# EasyEDA Pro project 步进电机天空星转接板.eprj, board PCB2
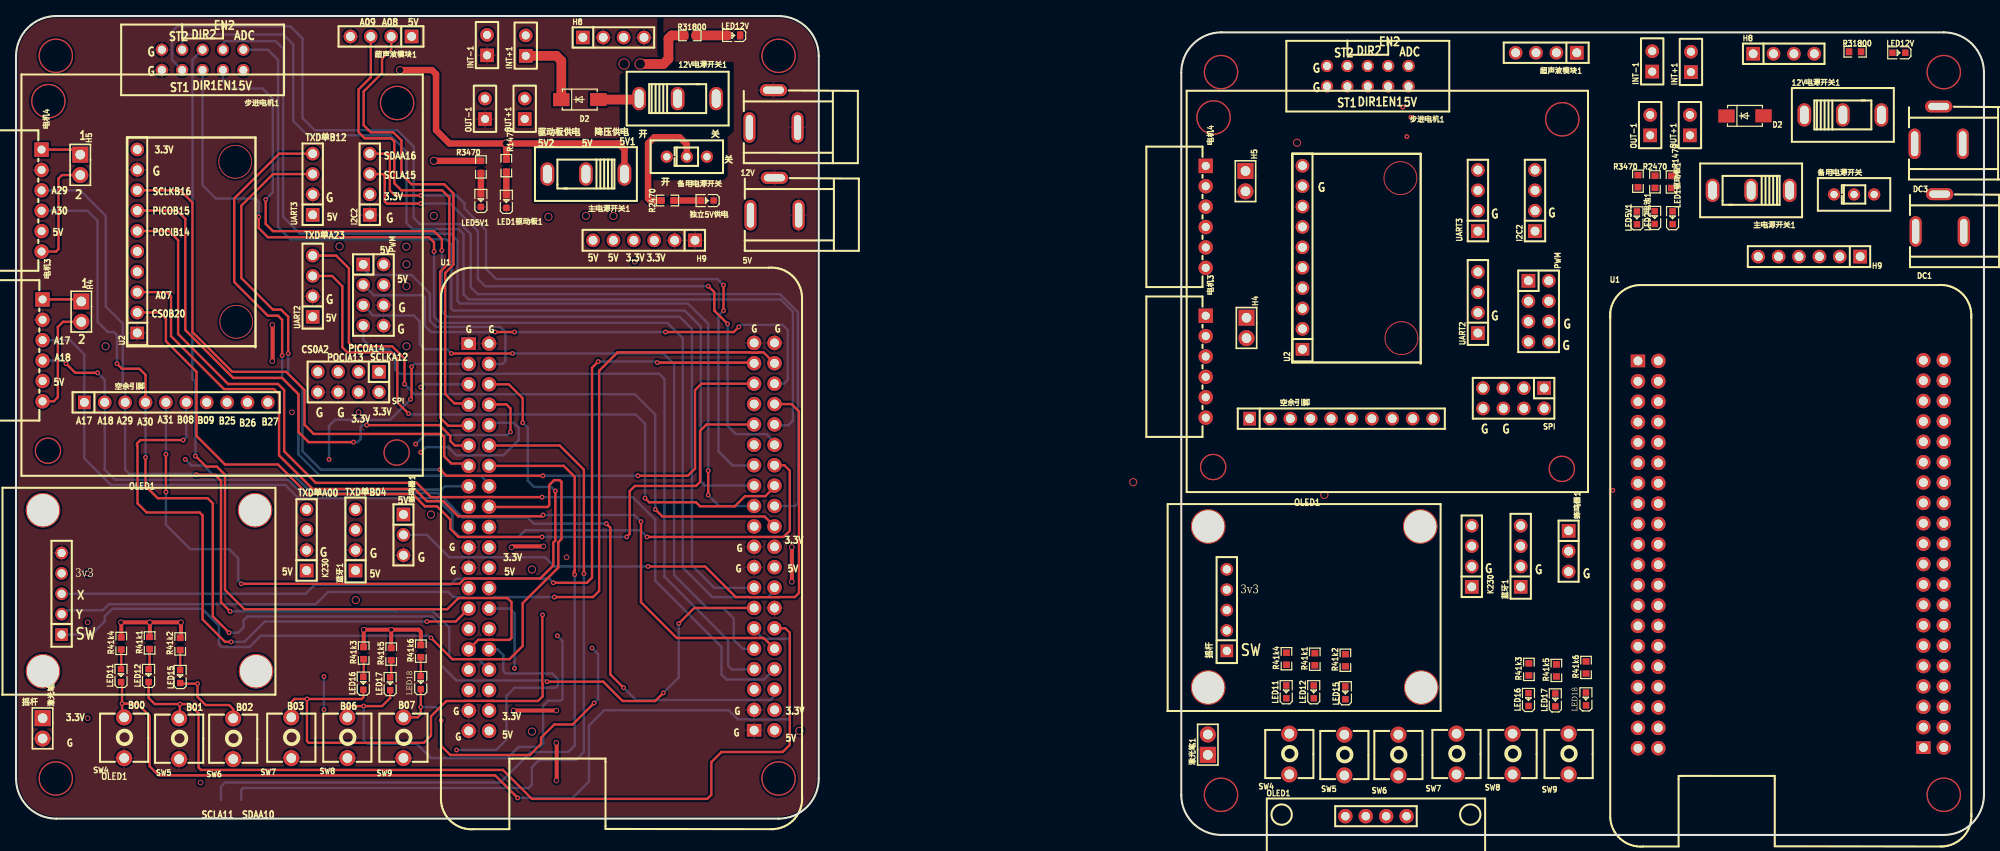
[diagram p4: board, top side]
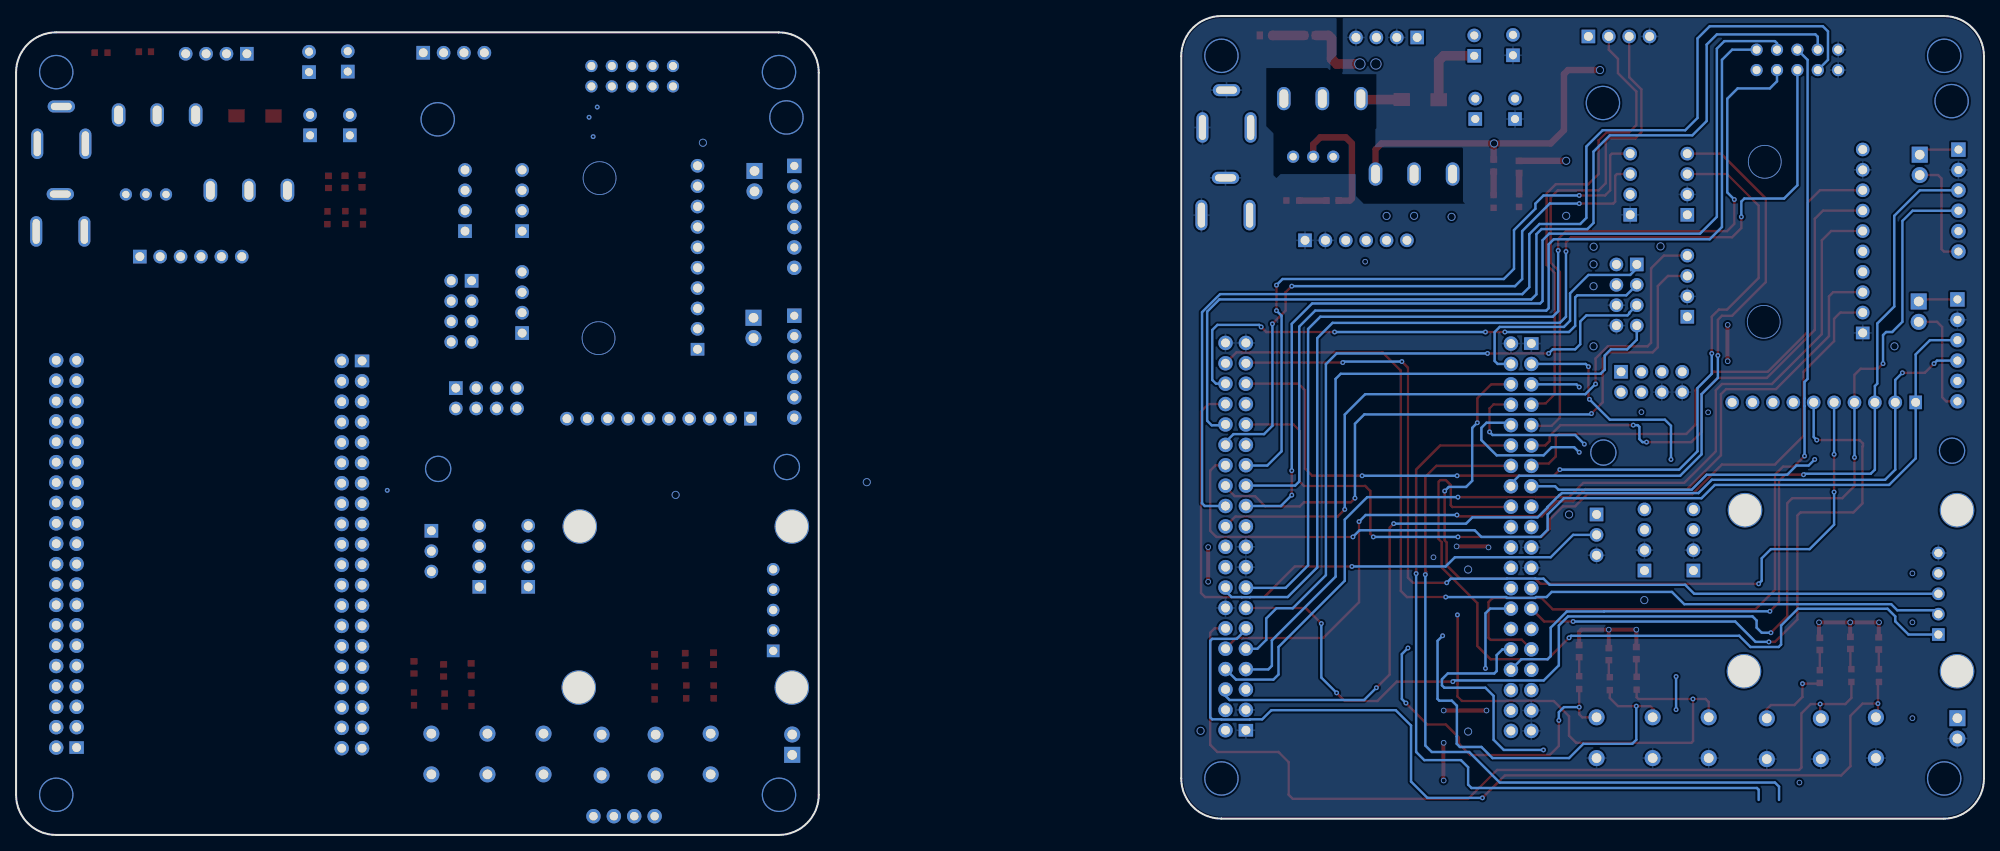
[diagram p5: board, bottom side, seen from below]

Outline 245.16 x 102.03 mm; copper layers: Top Layer, Inner1, Inner2, Bottom Layer. Coordinates in mm from the lower left corner of the outline.
Outline path: 0,97.03 0,7.03 arc(1.46,3.5) 5,2.03 95,2.03 arc(98.54,3.5) 100,7.03 100,97.03 arc(98.54,100.57) 95,102.03 5,102.03 arc(1.46,100.57) 0,97.03 ; 145.16,95 145.16,5 arc(146.63,1.46) 150.16,0 240.16,0 arc(243.7,1.46) 245.16,5 245.16,95 arc(243.7,98.54) 240.16,100 150.16,100 arc(146.63,98.54) 145.16,95
Stack: Top Layer 0.035mm / Dielectric1 1.51mm FR4 er 4.5 / Inner1 0.035mm / Dielectric2 0.48mm PP er 4.5 / Inner2 0.035mm / Dielectric3 0.48mm PP er 4.5 / Bottom Layer 0.035mm

## Design rules (mm)
template: JLCPCB Capability(Two Layers Board)
spacing copperThickness1oz (default): track to track 0.102, other pairs 0.152 to 0.3
spacing copperThickness2oz: track to track 0.203, other pairs 0.152 to 0.3
track width copperThickness1oz (default): min 0.127, default 0.254, max 2.54
track width copperThickness2oz: min 0.203, default 0.254, max 2.54
differential pair differentialPair (default): width min 0.127, default 0.254, max 2.54; gap min 0.152, default 0.152
via viaSize (default): diameter min 0.5, default 0.61, max 10; hole min 0.3, default 0.305, max 6.3

## Placement (name value [footprint] x y rotation side)
5V  DC005-T25  [DC-IN-TH_DC-005-20A-1]  94.49 79.55 180 top
12V  DC005-T25  [DC-IN-TH_DC-005-20A-1]  94.36 90.48 180 top
12V电源开关1  -  [SW-TH_SHOU-HAN_SS12D10G4]  227.58 89.71 0 top
12V电源开关1#2  -  [SW-TH_SHOU-HAN_SS12D10G4]  82.42 91.75 0 top
D2  -  [SMA_L4.3-W2.6-LS5.0-FD]  215.39 89.59 180 top
D2#2  -  [SMA_L4.3-W2.6-LS5.0-FD]  70.23 91.62 180 top
DC1  DC005-T25  [DC-IN-TH_DC-005-20A-1]  239.65 77.52 180 top
DC3  DC005-T25  [DC-IN-TH_DC-005-20A-1]  239.52 88.44 180 top
H4  -  [HDR-TH_2P-P2.54-V-M]  153.29 63.17 270 top
H4#2  -  [HDR-TH_2P-P2.54-V-M]  8.13 65.2 270 top
H5  -  [HDR-TH_2P-P2.54-V-M]  153.16 81.46 270 top
H5#2  -  [HDR-TH_2P-P2.54-V-M]  8 83.49 270 top
H8  -  [HDR-TH_4P-P2.54-V-M]  220.22 97.33 0 top
H8#2  -  [HDR-TH_4P-P2.54-V-M]  74.42 99.37 0 top
H9  -  [HDR-TH_6P-P2.54-V-M]  223.39 72.06 180 top
H9#2  -  [HDR-TH_6P-P2.54-V-M]  78.23 74.09 180 top
I2C2  -  [HDR-TH_4P-P2.54-V-M]  189.23 79.05 90 top
I2C2#2  -  [HDR-TH_4P-P2.54-V-M]  44.07 81.08 90 top
INT+1  -  [HDR-TH_2P-P2.54-V-F]  208.66 96.32 90 top
INT+1#2  -  [HDR-TH_2P-P2.54-V-F]  63.5 98.35 90 top
INT-1  -  [HDR-TH_2P-P2.54-V-F]  203.84 96.38 90 top
INT-1#2  -  [HDR-TH_2P-P2.54-V-F]  58.68 98.41 90 top
K230  -  [HDR-TH_4P-P2.54-V-M]  181.36 34.72 90 top
K230#2  -  [HDR-TH_4P-P2.54-V-M]  36.2 36.75 90 top
LED1驱动板1  LTST-C191KSKT  [LED0603-RD-YELLOW]  206.37 76.9 90 top
LED1驱动板1#2  -  [LED0603-RD-YELLOW]  61.09 78.93 90 top
LED2电池1  LTST-C191KSKT  [LED0603-RD-YELLOW]  204.14 76.92 90 top
LED5V1  LTST-C191KSKT  [LED0603-RD-YELLOW]  201.93 76.89 90 top
LED5V1#2  -  [LED0603-RD-YELLOW]  57.91 79.05 90 top
LED11  LTST-C191KSKT  [LED0603-RD-YELLOW]  158.24 17.83 90 top
LED11#2  -  [LED0603-RD-YELLOW]  13.08 19.86 90 top
LED12  LTST-C191KSKT  [LED0603-RD-YELLOW]  161.67 17.83 90 top
LED12#2  -  [LED0603-RD-YELLOW]  16.51 19.86 90 top
LED12V  -  [LED0603-RD-YELLOW]  234.57 97.46 180 top
LED12V#2  -  [LED0603-RD-YELLOW#2]  89.41 99.62 180 top
LED15  LTST-C191KSKT  [LED0603-RD-YELLOW]  165.61 17.7 90 top
LED15#2  -  [LED0603-RD-YELLOW]  20.45 19.74 90 top
LED16  LTST-C191KSKT  [LED0603-RD-YELLOW]  188.42 16.87 90 top
LED16#2  -  [LED0603-RD-YELLOW]  43.26 18.9 90 top
LED17  LTST-C191KSKT  [LED0603-RD-YELLOW]  191.77 16.81 90 top
LED17#2  -  [LED0603-RD-YELLOW]  46.61 18.85 90 top
LED18  -  [LED0603-RD-YELLOW]  195.58 16.94 90 top
LED18#2  -  [LED0603-RD-YELLOW]  50.42 18.97 90 top
NOREF  -  [Pad_e420]  3.35 20.4 180 top
NOREF#2  -  [Pad_e189]  148.51 18.37 180 top
NOREF#3  -  [Pad_e423]  29.9 20.4 180 top
NOREF#4  -  [Pad_e192]  175.06 18.37 180 top
NOREF#5  -  [Pad_e191]  174.93 38.43 180 top
NOREF#6  -  [Pad_e422]  29.77 40.46 180 top
NOREF#7  -  [Pad_e190]  148.51 38.43 180 top
NOREF#8  -  [Pad_e421]  3.35 40.46 180 top
OLED1  HS96L03W2C03  [OLED-TH_L27.8-W27.2-P2.54_C9900033791]  169.42 2.34 0 top
OUT+1  -  [HDR-TH_2P-P2.54-V-F]  208.53 88.44 90 top
OUT+1#2  -  [HDR-TH_2P-P2.54-V-F]  63.37 90.48 90 top
OUT-1  -  [HDR-TH_2P-P2.54-V-F]  203.58 88.44 90 top
OUT-1#2  -  [HDR-TH_2P-P2.54-V-F]  58.42 90.48 90 top
PWM  -  [HDR-TH_8P-P2.54-V-M-R2-C4-S2.54]  189.68 65.24 270 top
PWM#2  -  [HDR-TH_8P-P2.54-V-M-R2-C4-S2.54]  44.52 67.27 270 top
R41k1  -  [R0603#2]  161.8 21.9 90 top
R41k1#2  -  [R0603#2]  16.64 23.93 90 top
R41k2  -  [R0603#2]  165.61 21.77 90 top
R41k2#2  -  [R0603#2]  20.45 23.8 90 top
R41k3  -  [R0603#2]  188.47 20.62 90 top
R41k3#2  -  [R0603#2]  43.31 22.66 90 top
R41k4  -  [R0603#2]  158.27 21.96 90 top
R41k4#2  -  [R0603#2]  13.11 23.86 90 top
R41k5  1kΩ  [R0603#2]  191.9 20.5 90 top
R41k5#2  -  [R0603#2]  46.74 22.53 90 top
R41k6  -  [R0603#2]  195.59 20.87 90 top
R41k6#2  -  [R0603#2]  50.43 22.9 90 top
R1470  470Ω  [R0603#2]  206.24 81.36 270 top
R1470#2  -  [R0603#2]  61.08 83.39 270 top
R2470  470Ω  [R0603#2]  204.18 81.38 270 top
R2470#2  -  [R0603#2]  81.15 79.05 0 top
R3470  470Ω  [R0603#2]  202.06 81.46 270 top
R3470#2  -  [R0603#2]  57.91 83.24 270 top
R31800  -  [R0603]  83.95 99.62 0 top
R31800#2  -  [R0603#2]  229.11 97.59 0 top
SPI  -  [HDR-TH_8P-P2.54-V-M-R2-C4-S2.54]  186.56 54.41 180 top
SPI#2  -  [HDR-TH_8P-P2.54-V-M-R2-C4-S2.54]  41.4 56.44 180 top
SW4  K2-1104DZ-G4SW-04  [KEY-TH_2P-L6.0-W6.0-P5.00]  158.62 10.08 90 top
SW4#2  -  [KEY-TH_2P-L6.0-W6.0-P5.00]  13.46 12.12 90 top
SW5  -  [KEY-TH_2P-L6.0-W6.0-P5.00]  165.48 9.96 90 top
SW5#2  -  [KEY-TH_2P-L6.0-W6.0-P5.00]  20.32 11.99 90 top
SW6  -  [KEY-TH_2P-L6.0-W6.0-P5.00]  172.21 9.96 90 top
SW6#2  -  [KEY-TH_2P-L6.0-W6.0-P5.00]  27.05 11.99 90 top
SW7  -  [KEY-TH_2P-L6.0-W6.0-P5.00]  179.45 10.08 90 top
SW7#2  -  [KEY-TH_2P-L6.0-W6.0-P5.00]  34.29 12.12 90 top
SW8  -  [KEY-TH_2P-L6.0-W6.0-P5.00]  186.44 10.08 90 top
SW8#2  -  [KEY-TH_2P-L6.0-W6.0-P5.00]  41.27 12.12 90 top
SW9  -  [KEY-TH_2P-L6.0-W6.0-P5.00]  193.42 10.08 90 top
SW9#2  -  [KEY-TH_2P-L6.0-W6.0-P5.00]  48.26 12.12 90 top
U1  -  [COMM-TH_LCKFB-TMX-MSPM0G3507]  221.11 34.98 0 top
U1#2  -  [COMM-TH_LCKFB-TMX-MSPM0G3507]  75.44 37.14 0 top
U2  KH-2FH-1X20P-H4.3  [HDR-TH_10P-P2.54-V-F]  160.26 71.95 90 top
U2#2  -  [HDR-TH_10P-P2.54-V-F]  15.1 73.98 90 top
UART2  -  [HDR-TH_4P-P2.54-V-F]  182.12 66.35 90 top
UART2#2  -  [HDR-TH_4P-P2.54-V-F]  36.96 68.38 90 top
UART3  -  [HDR-TH_4P-P2.54-V-M]  182.12 79.05 90 top
UART3#2  -  [HDR-TH_4P-P2.54-V-M]  36.96 81.08 90 top
主电源开关1  SS12D10G5  [SW-TH_SHOU-HAN_SS12D10G4]  216.15 80.32 180 top
主电源开关1#2  -  [SW-TH_SHOU-HAN_SS12D10G4]  70.99 82.35 180 top
备用电源开关  -  [SW-TH_3P-L8.8-W3.9-P2.50_SS12D00G3]  228.98 79.81 0 top
备用电源开关#2  -  [SW-TH_3P-L8.8-W3.9-P2.50_SS12D00G3]  83.57 84.51 0 top
摇杆1  2.54-1*5P母  [HDR-TH_5P-P2.54-V-F]  150.84 28.02 90 top
摇杆1#2  -  [HDR-TH_5P-P2.54-V-F]  5.67 30.05 90 top
步进电机1  2.54-2*5P简牛  [IDC-TH_10P-P2.54_C5665]  168.4 94.54 180 top
步进电机1#2  -  [IDC-TH_10P-P2.54_C5665]  23.24 96.57 180 top
激光笔1  PZ254V-11-02P  [HDR-TH_2P-P2.54-V-M]  148.47 11.25 90 top
激光笔1#2  -  [HDR-TH_2P-P2.54-V-M]  3.31 13.28 270 top
独立5V供电  LTST-C191KSKT  [LED0603-RD-YELLOW]  86.11 79.05 180 top
电机3  -  [CONN-TH_6P-P2.54_HCTL_XH-6AW_C2908615]  148.21 58.34 270 top
电机3#2  -  [CONN-TH_6P-P2.54_HCTL_XH-6AW_C2908615]  3.3 60.38 270 top
电机4  -  [CONN-TH_6P-P2.54_HCTL_XH-6AW_C2908615]  148.21 77.01 270 top
电机4#2  -  [CONN-TH_6P-P2.54_HCTL_XH-6AW_C2908615]  3.17 79.05 270 top
空余引脚  -  [HDR-TH_10P-P2.54-V-M]  165.1 51.87 0 top
空余引脚#2  -  [HDR-TH_10P-P2.54-V-M]  19.94 53.9 0 top
蓝牙1  2.54-1*4P母  [HDR-TH_4P-P2.54-V-F]  187.45 34.72 90 top
蓝牙1#2  -  [HDR-TH_4P-P2.54-V-F]  42.29 36.75 90 top
蜂鸣器1  PZ254V-11-03P  [HDR-TH_3P-P2.54-V-M]  193.42 35.36 270 top
蜂鸣器1#2  -  [HDR-TH_3P-P2.54-V-M]  48.26 37.39 270 top
超声波模块1  KH-2.54FH-1X4P-H8.5  [HDR-TH_4P-P2.54-V-F]  190.63 97.46 180 top
超声波模块1#2  -  [HDR-TH_4P-P2.54-V-F]  45.47 99.49 180 top

## Footprints (pads in the part's own frame, mm; a bottom-side part is the same pattern mirrored in y, then rotated)
COMM-TH_LCKFB-TMX-MSPM0G3507
  rect 1.8x1.575 hole 1.1: 1(-19.05,24.09) 41(16.51,-24.09)
  round 1.8 hole 1.1: 2(-16.51,24.09) 3(-19.05,21.549) 4(-16.51,21.549) 5(-19.05,19.009) 6(-16.51,19.009) 7(-19.05,16.47) 8(-16.51,16.47) 9(-19.05,13.93) 10(-16.51,13.93) 11(-19.05,11.389) 12(-16.51,11.389) 13(-19.05,8.85) 14(-16.51,8.85) 15(-19.05,6.309) 16(-16.51,6.309) 17(-19.05,3.769) 18(-16.51,3.769) 19(-19.05,1.23) 20(-16.51,1.23) 21(-19.05,-1.31) 22(-16.51,-1.31) 23(-19.05,-3.85) 24(-16.51,-3.85) 25(-19.05,-6.391) 26(-16.51,-6.391) 27(-19.05,-8.931) 28(-16.51,-8.931) 29(-19.05,-11.47) 30(-16.51,-11.47) 31(-19.05,-14.011) 32(-16.51,-14.011) 33(-19.05,-16.55) 34(-16.51,-16.55) 35(-19.05,-19.09) 36(-16.51,-19.09) 37(-19.05,-21.631) 38(-16.51,-21.631) 39(-19.05,-24.171) 40(-16.51,-24.171) 42(19.05,-24.09) 43(16.51,-21.549) 44(19.05,-21.549) 45(16.51,-19.009) 46(19.05,-19.009) 47(16.51,-16.47) 48(19.05,-16.47) 49(16.51,-13.93) 50(19.05,-13.93) 51(16.51,-11.389) 52(19.05,-11.389) 53(16.51,-8.85) 54(19.05,-8.85) 55(16.51,-6.309) 56(19.05,-6.309) 57(16.51,-3.769) 58(19.05,-3.769) 59(16.51,-1.23) 60(19.05,-1.23) 61(16.51,1.31) 62(19.05,1.31) 63(16.51,3.85) 64(19.05,3.85) 65(16.51,6.391) 66(19.05,6.391) 67(16.51,8.931) 68(19.05,8.931) 69(16.51,11.47) 70(19.05,11.47) 71(16.51,14.011) 72(19.05,14.011) 73(16.51,16.55) 74(19.05,16.55) 75(16.51,19.09) 76(19.05,19.09) 77(16.51,21.631) 78(19.05,21.631) 79(16.51,24.171) 80(19.05,24.171)
CONN-TH_6P-P2.54_HCTL_XH-6AW_C2908615
  rect 1.8x1.8 hole 1: 1(-6.35,0)
  round 1.8 hole 1: 2(-3.81,0) 3(-1.27,0) 4(1.27,0) 5(3.81,0) 6(6.35,0)
DC-IN-TH_DC-005-20A-1
  oval 1.5x3.8 hole 0.9x3.1: 1(3,2.325) 2(-3,2.325)
  oval 3.4x1.5 hole 2.6x0.9: 3(0,-2.325)
HDR-TH_2P-P2.54-V-F
  rect 1.7x1.7 hole 1: 1(-1.27,0)
  round 1.7 hole 1: 2(1.27,0)
HDR-TH_2P-P2.54-V-M
  rect 2x2 hole 1.2: 1(-1.27,0)
  round 2 hole 1.2: 2(1.27,0)
HDR-TH_3P-P2.54-V-M
  rect 1.7x1.7 hole 1.1: 1(-2.54,0)
  round 1.7 hole 1.1: 2(0,0) 3(2.54,0)
HDR-TH_4P-P2.54-V-F
  rect 1.7x1.7 hole 1.1: 1(-3.81,0)
  round 1.7 hole 1.1: 2(-1.27,0) 3(1.27,0) 4(3.81,0)
HDR-TH_4P-P2.54-V-M
  rect 1.7x1.7 hole 1.1: 1(-3.81,0)
  round 1.7 hole 1.1: 2(-1.27,0) 3(1.27,0) 4(3.81,0)
HDR-TH_5P-P2.54-V-F
  rect 1.575x1.575 hole 1.02: 1(-5.08,0)
  round 1.575 hole 1.02: 2(-2.54,0) 3(0,0) 4(2.54,0) 5(5.08,0)
HDR-TH_6P-P2.54-V-M
  rect 1.7x1.7 hole 1.1: 1(-6.35,0)
  round 1.7 hole 1.1: 2(-3.81,0) 3(-1.27,0) 4(1.27,0) 5(3.81,0) 6(6.35,0)
HDR-TH_8P-P2.54-V-M-R2-C4-S2.54
  rect 1.7x1.7 hole 1.1: 1(-3.81,-1.27)
  round 1.7 hole 1.1: 2(-3.81,1.27) 3(-1.27,-1.27) 4(-1.27,1.27) 5(1.27,-1.27) 6(1.27,1.27) 7(3.81,-1.27) 8(3.81,1.27)
HDR-TH_10P-P2.54-V-F
  rect 1.575x1.7 hole 1.1: 1(-11.43,0)
  round 1.7 hole 1.1: 2(-8.89,0) 3(-6.35,0) 4(-3.81,0) 5(-1.27,0) 6(1.27,0) 7(3.81,0) 8(6.35,0) 9(8.89,0) 10(11.43,0)
HDR-TH_10P-P2.54-V-M
  rect 1.575x1.7 hole 1.1: 1(-11.43,0)
  round 1.7 hole 1.1: 2(-8.89,0) 3(-6.35,0) 4(-3.81,0) 5(-1.27,0) 6(1.27,0) 7(3.81,0) 8(6.35,0) 9(8.89,0) 10(11.43,0)
IDC-TH_10P-P2.54_C5665
  round 1.524 hole 1: 1(-5.08,-1.27) 2(-5.08,1.27) 3(-2.54,-1.27) 4(-2.54,1.27) 5(0,-1.27) 6(0,1.27) 7(2.54,-1.27) 8(2.54,1.27) 9(5.08,-1.27) 10(5.08,1.27)
KEY-TH_2P-L6.0-W6.0-P5.00
  round 2 hole 1.2: 1(-2.54,0) 2(2.54,0)
LED0603-RD-YELLOW
  rect 0.8x0.8 smd: 1(-0.799,-0.004) 2(0.799,0.004)
LED0603-RD-YELLOW#2
  rect 0.8x1 smd: 1(-0.799,-0.004) 2(0.799,0.004)
OLED-TH_L27.8-W27.2-P2.54_C9900033791
  round 1.8 hole 1.05: 1(-3.81,0) 2(-1.27,0) 3(1.27,0) 4(3.81,0)
Pad_e189
  round 4.3 hole 4: 1(0,0)
Pad_e190
  round 4.3 hole 4: 1(0,0)
Pad_e191
  round 4.3 hole 4: 1(0,0)
Pad_e192
  round 4.3 hole 4: 1(0,0)
Pad_e420
  round 4.3 hole 4: 1(0,0)
Pad_e421
  round 4.3 hole 4: 1(0,0)
Pad_e422
  round 4.3 hole 4: 1(0,0)
Pad_e423
  round 4.3 hole 4: 1(0,0)
R0603
  rect 1.1x1 smd: 1(-0.753,0)
  rect 1x1 smd: 2(0.753,0)
R0603#2
  rect 0.806x0.864 smd: 1(-0.753,0) 2(0.753,0)
SMA_L4.3-W2.6-LS5.0-FD
  rect 2.046x1.62 smd: 1(-2.304,-0.009) 2(2.304,0.009)
SW-TH_3P-L8.8-W3.9-P2.50_SS12D00G3
  round 1.524 hole 0.914: 1(-2.5,0) 2(0,0) 3(2.5,0)
SW-TH_SHOU-HAN_SS12D10G4
  oval 1.7x2.9 hole 1.1x2.3: 1(-4.8,0) 2(0,0) 3(4.8,0)

## Nets
3V3: H9.3 H9.4 H9#2.3 H9#2.4 I2C2.2 I2C2#2.2 OLED1.2 R41k1.2 R41k1#2.2 R41k2.2 R41k2#2.2 R41k3.2 R41k3#2.2 R41k4.2 R41k4#2.2 R41k5.2 R41k5#2.2 R41k6.2 R41k6#2.2 SPI.2 SPI.4 SPI#2.2 SPI#2.4 U1.22 U1.38 U1.44 U1.60 U1#2.22 U1#2.38 U1#2.44 U1#2.60 U2.10 U2#2.10 摇杆1.4 摇杆1#2.4 激光笔1.1 激光笔1#2.1
5V: H9.5 H9.6 H9#2.5 H9#2.6 K230.1 K230#2.1 PWM.2 PWM.4 PWM#2.2 PWM#2.4 R3470.1 R3470#2.1 U1.24 U1.40 U1.42 U1.58 U1#2.24 U1#2.40 U1#2.42 U1#2.58 UART2.1 UART2#2.1 UART3.1 UART3#2.1 主电源开关1.1 主电源开关1#2.2 备用电源开关.1 备用电源开关#2.1 电机3.5 电机3#2.5 电机4.5 电机4#2.5 蓝牙1.1 蓝牙1#2.1 蜂鸣器1.1 蜂鸣器1#2.1 超声波模块1.1 超声波模块1#2.1
5V1: R1470.1 R1470#2.1 主电源开关1.2 主电源开关1#2.1 步进电机1.2 步进电机1#2.2
5V2: OUT+1.1 OUT+1#2.1 主电源开关1.3 主电源开关1#2.3
12V: 12V电源开关1.1 12V电源开关1#2.1 D2.1 D2#2.1 H8.1 H8.3 H8#2.1 H8#2.3 R31800.1 R31800#2.1
AGND: U1.35 U1#2.35
GND: 5V.2 5V.3 12V.2 12V.3 DC1.2 DC1.3 DC3.2 DC3.3 H8.2 H8.4 H8#2.2 H8#2.4 H9.1 H9.2 H9#2.1 H9#2.2 I2C2.1 I2C2#2.1 INT-1.1 INT-1#2.1 K230.2 K230#2.2 LED1驱动板1.1 LED1驱动板1#2.1 LED2电池1.1 LED5V1.1 LED5V1#2.1 LED12V.1 LED12V#2.1 OLED1.1 OUT-1.1 OUT-1#2.1 PWM.6 PWM.8 PWM#2.6 PWM#2.8 SPI.6 SPI.8 SPI#2.6 SPI#2.8 SW4.1 SW4#2.1 SW5.1 SW5#2.1 SW6.1 SW6#2.1 SW7.1 SW7#2.1 SW8.1 SW8#2.1 SW9.1 SW9#2.1 U1.1 U1.2 U1.21 U1.23 U1.37 U1.39 U1.41 U1.43 U1.54 U1.57 U1.59 U1.79 U1.80 U1#2.1 U1#2.2 U1#2.21 U1#2.23 U1#2.37 U1#2.39 U1#2.41 U1#2.43 U1#2.54 U1#2.57 U1#2.59 U1#2.79 U1#2.80 U2.1 U2.9 U2#2.1 U2#2.9 UART2.2 UART2#2.2 UART3.2 UART3#2.2 摇杆1.5 摇杆1#2.5 步进电机1.9 步进电机1.10 步进电机1#2.9 步进电机1#2.10 激光笔1.2 激光笔1#2.2 独立5V供电.1 电机3.2 电机3#2.2 电机4.2 电机4#2.2 蓝牙1.2 蓝牙1#2.2 蜂鸣器1.3 蜂鸣器1#2.3 超声波模块1.4 超声波模块1#2.4
V5: 5V.1 DC1.1 R2470.1 R2470#2.1 备用电源开关.2 备用电源开关#2.2
V12: 12V.1 12V电源开关1.2 12V电源开关1#2.2 DC3.1
CHIP: U1.36 U1#2.36
CLK: U1.20 U1#2.20
DIO: U1.19 U1#2.19
M31: H4.1 H4#2.1 电机3.1 电机3#2.1
M32: H4.2 H4#2.2 电机3.6 电机3#2.6
M41: H5.1 H5#2.1 电机4.1 电机4#2.1
M42: H5.2 H5#2.2 电机4.6 电机4#2.6
PA00: K230.4 K230#2.4 U1.3 U1#2.3
PA01: K230.3 K230#2.3 U1.5 U1#2.5
PA02: SPI.7 SPI#2.7 U1.61 U1#2.61
PA07: U1.50 U1#2.50 U2.3 U2#2.3
PA08: U1.7 U1#2.7 超声波模块1.2 超声波模块1#2.2
PA09: U1.9 U1#2.9 超声波模块1.3 超声波模块1#2.3
PA10: OLED1.4 U1.12 U1#2.12
PA11: OLED1.3 U1.14 U1#2.14
PA12: SPI.1 SPI#2.1 U1.29 U1#2.29
PA13: SPI.5 SPI#2.5 U1.30 U1#2.30
PA14: SPI.3 SPI#2.3 U1.69 U1#2.69
PA15: I2C2.3 I2C2#2.3 U1.70 U1#2.70
PA16: I2C2.4 I2C2#2.4 U1.67 U1#2.67
PA17: U1.68 U1#2.68 电机3.3 电机3#2.3 空余引脚.1 空余引脚#2.1
PA18: U1.46 U1#2.46 电机3.4 电机3#2.4 空余引脚.2 空余引脚#2.2
PA21: U1.64 U1#2.64 步进电机1.8 步进电机1#2.8
PA22: U1.72 U1#2.72 步进电机1.7 步进电机1#2.7
PA23: U1.62 U1#2.62 UART2.4 UART2#2.4
PA24: PWM.3 PWM#2.3 U1.76 U1#2.76
PA25: U1.75 U1#2.75 UART3.3 UART3#2.3
PA26: U1.78 U1#2.78 摇杆1.2 摇杆1#2.2
PA27: U1.77 U1#2.77 摇杆1.3 摇杆1#2.3
PA28: PWM.1 PWM#2.1 U1.4 U1#2.4
PA29: U1.34 U1#2.34 电机4.3 电机4#2.3 空余引脚.3 空余引脚#2.3
PA30: U1.53 U1#2.53 电机4.4 电机4#2.4 空余引脚.4 空余引脚#2.4
PA31: U1.6 U1#2.6 空余引脚.5 空余引脚#2.5
PB00: LED11.1 LED11#2.1 SW4.2 SW4#2.2 U1.51 U1#2.51
PB01: LED12.1 LED12#2.1 SW5.2 SW5#2.2 U1.52 U1#2.52
PB02: LED15.1 LED15#2.1 SW6.2 SW6#2.2 U1.15 U1#2.15
PB03: LED16.1 LED16#2.1 SW7.2 SW7#2.2 U1.17 U1#2.17
PB04: U1.8 U1#2.8 蓝牙1.4 蓝牙1#2.4
PB05: U1.10 U1#2.10 蓝牙1.3 蓝牙1#2.3
PB06: LED17.1 LED17#2.1 SW8.2 SW8#2.2 U1.25 U1#2.25
PB07: LED18.1 LED18#2.1 SW9.2 SW9#2.2 U1.26 U1#2.26
PB08: U1.27 U1#2.27 空余引脚.6 空余引脚#2.6
PB09: U1.28 U1#2.28 空余引脚.7 空余引脚#2.7
PB10: PWM.5 PWM#2.5 U1.49 U1#2.49
PB11: PWM.7 PWM#2.7 U1.47 U1#2.47
PB12: U1.16 U1#2.16 UART3.4 UART3#2.4
PB13: U1.18 U1#2.18 摇杆1.1 摇杆1#2.1
PB14: U1.48 U1#2.48 U2.6 U2#2.6
PB15: U1.11 U1#2.11 U2.7 U2#2.7
PB16: U1.13 U1#2.13 U2.8 U2#2.8
PB17: U1.65 U1#2.65 步进电机1.1 步进电机1#2.1
PB18: U1.66 U1#2.66 UART2.3 UART2#2.3
PB19: U1.63 U1#2.63 步进电机1.3 步进电机1#2.3
PB20: U1.71 U1#2.71 U2.2 U2#2.2
PB21: U1.55 U1#2.55 步进电机1.4 步进电机1#2.4
PB22: U1.56 U1#2.56 步进电机1.6 步进电机1#2.6
PB23: U1.31 U1#2.31 步进电机1.5 步进电机1#2.5
PB24: U1.74 U1#2.74 蜂鸣器1.2 蜂鸣器1#2.2
PB25: U1.73 U1#2.73 空余引脚.8 空余引脚#2.8
PB26: U1.32 U1#2.32 空余引脚.9 空余引脚#2.9
PB27: U1.33 U1#2.33 空余引脚.10 空余引脚#2.10
RST: U1.45 U1#2.45
$1N2097: LED2电池1.2 R2470.2 R2470#2.2 独立5V供电.2
$1N2098: LED1驱动板1.2 LED1驱动板1#2.2 R1470.2 R1470#2.2
$1N2102: LED5V1.2 LED5V1#2.2 R3470.2 R3470#2.2
$1N3077: LED12V.2 LED12V#2.2 R31800.2 R31800#2.2
$1N6588: LED11.2 LED11#2.2 R41k4.1 R41k4#2.1
$1N6591: LED12.2 LED12#2.2 R41k1.1 R41k1#2.1
$1N6592: LED15.2 LED15#2.2 R41k2.1 R41k2#2.1
$1N6593: LED16.2 LED16#2.2 R41k3.1 R41k3#2.1
$1N6603: LED17.2 LED17#2.2 R41k5.1 R41k5#2.1
$1N6604: LED18.2 LED18#2.2 R41k6.1 R41k6#2.1
$1N7225: D2.2 D2#2.2 INT+1.1 INT+1#2.1

Pads without a net: 12V电源开关1 3; 12V电源开关1#2 3; INT+1 2; INT+1#2 2; INT-1 2; INT-1#2 2; NOREF 1; NOREF#2 1; NOREF#3 1; NOREF#4 1; NOREF#5 1; NOREF#6 1; NOREF#7 1; NOREF#8 1; OUT+1 2; OUT+1#2 2; OUT-1 2; OUT-1#2 2; U2 4 5; U2#2 4 5; 备用电源开关 3; 备用电源开关#2 3

## Via types
v1: diameter 4.2, hole 4, Top Layer to Bottom Layer, 4 vias
v2: diameter 4.3, hole 4, Top Layer to Bottom Layer, 12 vias
v3: diameter 3.3, hole 3, Top Layer to Bottom Layer, 4 vias
v4: diameter 0.7, hole 0.5, Top Layer to Bottom Layer, 23 vias
v5: diameter 0.61, hole 0.305, Top Layer to Bottom Layer, 92 vias
v6: diameter 1, hole 0.8, Top Layer to Bottom Layer, 21 vias
v7: diameter 1.4, hole 1.2, Top Layer to Bottom Layer, 2 vias

## Routing (per net, layer and track width the routed paths; a pad name or vN(x,y) marks a point on that pad's centre or on a via; arc(x,y) is an arc through that point)
3V3: length 467.2
  Top Layer w0.5: v4(46.74,25.58) v4(43.31,25.58) R41k3#2.2 ; v4(46.74,25.58) 46.74,23.29 R41k5#2.2 ; v4(46.74,25.58) 50.16,25.58 50.43,25.32 R41k6#2.2 ; v4(16.66,26.49) v4(13.07,26.49) 13.11,26.46 R41k4#2.2 ; v4(16.66,26.49) 16.66,24.71 R41k1#2.2 ; v4(16.66,26.49) v4(20.55,26.49) 20.55,24.65 R41k2#2.2 ; v4(65.7,35.95) 61.85,35.95 v4(61.72,35.82) ; v4(67.31,11.48) 67.35,11.44 67.35,6.82 v4(67.31,6.78) ; v4(31.92,63.55) 31.96,63.52 31.96,59.06 v4(31.92,59.03) ; v4(96.65,35.87) v4(96.65,31.55) ; v4(61.98,15.5) v4(67.31,15.5)
  Inner1 w0.5: v4(77.09,71.43) 77.09,69.62 77.44,69.27 96.14,69.27 98.02,67.39 98.02,37.36 97.66,37.01 96.9,37.01 96.65,36.75 v4(96.65,35.87) 94.53,35.87 U1#2.60 ; v4(77.09,71.43) 77.09,73.97 H9#2.4 ; v4(77.09,71.43) 78.88,71.43 79.5,72.05 H9#2.3 ; v4(77.09,71.43) 72.14,71.43 69.95,69.24 69.95,34.95 69.6,34.6 v4(68.58,34.6) ; v4(43.31,25.58) 42.04,25.58 41.12,26.49 v4(20.55,26.49) ; v4(22.99,6.53) 67.06,6.53 v4(67.31,6.78) ; v4(22.99,6.53) 22.99,4.37 ; v4(22.99,6.53) 10.03,6.53 8.91,7.65 v4(8.91,14.55) ; 31.92,90.09 40.13,90.09 41.15,89.08 41.15,80.32 41.66,79.81 I2C2#2.2 ; 31.92,90.09 23.24,90.09 18.56,85.41 U2#2.10 ; 31.92,90.09 v4(31.92,63.55) ; 42.7,52.66 44.86,52.66 45.21,53.01 SPI#2.2 ; 42.7,52.66 v4(34.36,52.66) ; 42.7,52.66 v4(42.67,52.68) SPI#2.4 ; v4(8.91,32.59) 摇杆1#2.4 ; v4(8.91,32.59) 10.44,32.59 10.8,32.94 10.8,44.25 12.57,46.03 34.29,46.03 34.36,46.1 v4(34.36,52.66) ; v4(8.91,32.59) v4(8.91,26.49) ; v4(34.36,52.66) 34.26,52.66 33.91,53.01 33.91,58.09 33.4,58.6 32.35,58.6 v4(31.92,59.03) ; v4(8.91,26.49) v4(8.91,14.55) ; v4(8.91,26.49) v4(13.07,26.49) ; v4(8.91,14.55) 激光笔1#2.1 ; v4(65.7,35.95) 67.06,34.6 v4(68.58,34.6) ; U1#2.22 v4(61.72,35.82) ; U1#2.44 94.53,15.55 96.52,15.55 96.65,15.67 v4(96.65,31.55) ; v4(68.58,34.6) 68.58,16.77 v4(67.31,15.5) v4(67.31,11.48) ; U1#2.38 v4(61.98,15.5)
5V: length 399.1
  Top Layer w0.8: R3470#2.1 52.05,83.99 v6(52.04,84)
  Inner1 w0.8: v6(52.04,77.14) 53,76.19 63.95,76.19 64.77,77.01 v6(66.33,77.01) ; v6(52.04,77.14) v6(52.04,84) 52.04,99.14 51.69,99.49 超声波模块1#2.1 ; v6(52.04,77.14) 50.16,77.14 49.4,76.38 49.4,74.05 48.64,73.29 ; v6(70.99,77.14) 74.41,77.14 ; v6(70.99,77.14) 主电源开关1#2.2 ; v6(70.99,77.14) 70.99,74.98 H9#2.6 ; 74.41,77.14 80.65,77.14 81.19,77.69 81.19,84.38 备用电源开关#2.1 ; 74.41,77.14 v6(74.42,77.13) H9#2.5 ; v6(48.64,68.37) 45.96,68.37 PWM#2.4 ; v6(48.64,68.37) v6(48.64,60.88) ; v6(48.64,68.37) v6(48.64,71.1) ; v6(64.26,33.07) 64.26,72.19 66.33,74.25 v6(66.33,77.01) ; v6(64.26,33.07) v6(64.26,12.88) ; v6(64.26,33.07) 59.52,33.07 59.44,33.16 ; v6(11.15,60.88) 9.27,60.88 7.75,59.36 7.75,57.58 6.6,56.44 3.43,56.44 电机3#2.5 ; v6(11.15,60.88) 11.15,73.86 9.78,75.24 电机4#2.5 ; v6(11.15,60.88) v6(48.64,60.88) ; U1#2.42 94.56,12.98 v6(97.59,12.98) ; v6(97.59,12.98) 97.59,11.28 97.03,10.72 89.79,10.72 88.14,9.07 66.5,9.07 64.26,11.3 v6(64.26,12.88) ; v6(97.59,12.98) 98.3,13.68 98.3,32.56 97.54,33.33 94.53,33.33 U1#2.58 ; v6(48.64,60.88) 51.69,57.84 v6(51.69,39.93) ; 40.18,73.33 40.18,76.71 39.62,77.27 UART3#2.1 ; 40.18,73.33 40.19,73.33 v6(40.3,73.33) 40.25,73.29 ; 40.18,73.33 40.22,73.29 40.25,73.29 ; v6(66.33,77.01) 70.87,77.01 70.99,77.14 ; 48.64,73.29 v6(48.64,71.1) ; 48.64,73.29 48.63,73.29 v6(48.62,73.29) 40.25,73.29 ; UART2#2.1 37.08,64.44 38.99,64.44 40.25,65.71 40.25,73.29 ; v6(42.31,29.26) 42.29,29.28 蓝牙1#2.1 ; v6(42.31,29.26) 36.83,29.26 36.2,29.9 K230#2.1 ; v6(42.31,29.26) 50.42,29.26 51.69,30.53 v6(51.69,39.93) ; 59.44,12.84 59.48,12.88 v6(64.26,12.88) ; PWM#2.2 48.62,71.08 v6(48.64,71.1) ; v6(51.69,39.93) 蜂鸣器1#2.1
  vias: v6(139.18,43.96) v6(159.59,86.25) v6(162.99,42.37)
5V1: length 60.8
  Top Layer w0.8: 主电源开关1#2.1 75.79,85.42 75.06,86.16 v6(61.03,86.16) ; v6(61.03,86.16) 61.08,86.11 R1470#2.1 ; v6(61.03,86.16) 53.98,86.16 52.32,87.81 52.32,94.79 51.82,95.3 v6(47.84,95.3)
  Inner1 w0.8: 步进电机1#2.2 v6(47.84,95.3)
5V2: length 9.4
  Inner1 w0.8: 主电源开关1#2.3 66.19,88.8 65.79,89.21 OUT+1#2.1
12V: length 31.2
  Top Layer w1.2: D2#2.1 77.51,91.63 12V电源开关1#2.1 ; v7(77.75,96.06) 80.65,96.06 81.28,96.7 81.28,99.24 81.66,99.62 R31800.1
  Inner1 w1.2: H8#2.3 75.75,99.31 v7(75.75,96.06) ; v7(75.75,96.06) v7(77.75,96.06) 77.75,91.87 12V电源开关1#2.1 ; v7(75.75,96.06) 71.37,96.06 70.74,96.7 70.74,99.24 H8#2.1
V5: length 30.6
  Top Layer w0.8: R2470#2.1 78.99,79.05 78.74,79.3 78.74,86.16 79.5,86.92 82.68,86.92 83.57,86.03 备用电源开关#2.2
  Inner1 w0.8: 备用电源开关#2.2 83.82,84.25 83.82,77.65 84.46,77.01 91.27,77.01 5V.1
V12: length 25
  Inner1 w0.254: 12V电源开关1.2 227.58,86.16 228.09,85.65 236.05,85.65 DC3.1
  Inner1 w1.2: 12V电源开关1#2.2 82.42,88.82 82.93,88.32 91.19,88.32 12V.1
(no net):
  vias: v1(27.3,83.87) v1(27.43,63.93) v1(172.47,81.84) v1(172.59,61.9) v2(4.03,91.43) v2(4.95,97.08) v2(4.95,7.04) v2(47.47,91.2) v2(95,97.08) v2(95,7.04) v2(149.19,89.4) v2(150.11,95.05) v2(150.11,5) v2(192.63,89.17) v2(240.16,95.05) v2(240.16,5) v3(3.97,47.88) v3(47.42,47.64) v3(149.14,45.84) v3(192.58,45.61)
M31: length 4.9
  Top Layer w0.3: H4#2.1 7.87,66.73 电机3#2.1
M32: length 14.1
  Top Layer w0.3: 电机3#2.6 4.7,54.03 5.21,54.53 5.21,63.3 5.84,63.93 H4#2.2
M41: length 5.1
  Top Layer w0.3: H5#2.1 7.37,85.4 电机4#2.1
M42: length 13.9
  Top Layer w0.3: 3.17,72.7 4.99,72.7 5.29,73 5.29,81.79 5.71,82.22 H5#2.2
PA00: length 35.8
  Top Layer w0.3: v5(49.15,54.28) 49.28,54.41 v5(49.28,58.34)
  Inner1 w0.3: v5(38.99,46.79) 38.99,41.07 38.48,40.56 K230#2.4
  Bottom Layer w0.3: v5(49.15,54.28) 46.61,51.74 39.75,51.74 38.99,50.98 v5(38.99,46.79) ; U1#2.3 49.62,58.68 v5(49.28,58.34)
PA01: length 35.2
  Inner1 w0.3: K230#2.3 39.12,38.02 39.62,38.53 39.62,45.9 40.89,47.17 42.67,47.17 43.31,47.8 43.31,49.45 44.2,50.34 48.77,50.34 50.42,51.99 v5(50.42,55.8)
  Bottom Layer w0.3: U1#2.5 50.76,56.14 v5(50.42,55.8)
PA02: length 106.4
  Inner2 w0.3: U1#2.61 90.34,38.45 89.41,37.52 89.41,22.04 89.15,21.79 54.85,21.79 52.83,23.8 52.83,43.1 52.32,43.61 38.23,43.61 36.07,45.77 36.07,57.46 36.32,57.71 SPI#2.7
PA07: length 111.2
  Top Layer w0.3: U1#2.50 93.15,24.54 82.31,24.54 77.85,29.01 v5(77.85,39.04) ; U2#2.3 18.78,67.63 19.3,67.11 19.3,62.15 25.91,55.55 32.13,55.55 32.77,54.92 32.77,47.3 36.96,43.1 49.66,43.1 51.18,41.58 53.21,41.58 55.09,39.7 65.5,39.7 v5(65.66,39.87)
  Bottom Layer w0.3: v5(65.66,39.87) 77.03,39.87 v5(77.85,39.04)
PA08: length 58.5
  Top Layer w0.3: U1#2.7 56.22,53.77 54.61,53.77 53.47,54.92 53.47,70.03 54.48,71.04 54.48,79.93 53.34,81.08 49.28,81.08 48.01,82.35 48.01,86.54 46.99,87.55 44.2,87.55 43.31,88.44 43.31,92.63 45.59,94.92 45.59,96.7 46.74,97.84 超声波模块1#2.2
PA09: length 62.2
  Top Layer w0.3: 超声波模块1#2.3 44.2,94.41 42.67,92.89 42.67,87.55 43.43,86.79 46.74,86.79 47.12,86.41 47.12,81.2 48.01,80.32 53.09,80.32 53.98,79.43 53.98,71.3 52.83,70.16 52.83,51.99 53.85,50.98 56.3,50.98 U1#2.9
PA10: length 95.4
  Top Layer w0.3: U1#2.12 67.73,48.52 70.74,45.52 v5(70.74,32.56)
  Bottom Layer w0.3: 28.07,4.37 28.07,5.64 28.28,5.85 63.84,5.85 64.26,6.27 64.26,8.43 65.15,9.32 69.72,9.32 70.74,10.34 v5(70.74,32.56)
PA11: length 92.6
  Top Layer w0.3: v5(69.6,32.44) 69.5,32.54 69.5,32.81 69.6,32.91 69.6,44.63 68.24,45.98 U1#2.14
  Bottom Layer w0.3: v5(69.6,32.44) 69.6,11.15 68.79,10.34 64.13,10.34 60.32,6.53 26.03,6.53 25.53,6.02 25.53,4.37
PA12: length 41.3
  Inner2 w0.3: SPI#2.1 47.88,57.71 48.26,57.33 51.82,57.33 54.36,54.79 54.36,26.09 54.78,25.66 U1#2.29
  vias: v5(198.92,42.94)
PA13: length 52.1
  Inner2 w0.3: SPI#2.5 38.86,56.44 38.86,52.38 41.02,50.22 52.71,50.22 53.59,49.33 53.59,25.2 54.33,24.46 57.73,24.46 U1#2.30
PA14: length 58.4
  Inner2 w0.3: SPI#2.3 44.58,59.61 52.45,59.61 54.61,57.46 87.58,57.46 87.88,57.16 87.88,50.72 90,48.61 U1#2.69
PA15: length 78.8
  Top Layer w0.3: I2C2#2.3 45.72,82.35 45.93,82.14 45.93,78.92 46.19,78.66 v5(50.42,78.66) ; v5(86.23,68.38) 87,67.62 87,65.33 v5(88.65,63.68)
  Bottom Layer w0.3: v5(88.65,63.68) 88.65,50.98 89.68,49.94 93.49,49.94 94.49,48.95 U1#2.70 ; v5(86.23,68.38) 58.42,68.38 57.53,69.27 57.53,75.24 54.1,78.66 v5(50.42,78.66)
PA16: length 82.8
  Top Layer w0.3: v5(50.42,79.68) 47.2,79.68 46.57,80.32 46.57,84.68 46.35,84.89 I2C2#2.4 ; v5(88.14,68.5) v5(88.14,65.33)
  Bottom Layer w0.3: U1#2.67 91.91,46.03 89.28,46.03 87.5,47.8 87.5,64.69 v5(88.14,65.33) ; v5(50.42,79.68) 54.86,79.68 55.88,78.66 55.88,78.03 58.55,75.36 58.55,70.54 59.82,69.27 87.38,69.27 v5(88.14,68.5)
PA17: length 122.6
  Top Layer w0.3: U1#2.68 95.72,46.07 96.39,45.39 96.39,37.9 95.63,37.14 v5(78.61,37.14)
  Bottom Layer w0.3: 电机3#2.3 6.73,61.65 8.51,59.87 空余引脚#2.1 8.51,46.91 11.81,43.61 33.53,43.61 35.18,41.96 52.32,41.96 54.36,39.93 54.36,38.02 55.24,37.14 62.61,37.14 63.44,37.96 77.79,37.96 v5(78.61,37.14)
PA18: length 127
  Top Layer w0.3: v5(73.53,38.79) 74.04,38.28 74.04,19.99 v5(75.69,18.34) ; v5(6.22,58.73) 7.37,57.58 v5(10.16,57.58)
  Bottom Layer w0.3: v5(6.22,58.73) 5.84,59.11 电机3#2.4 ; v5(10.16,57.58) 11.05,56.69 空余引脚#2.2 11.05,45.52 12.32,44.25 33.91,44.25 35.56,42.6 52.58,42.6 52.81,42.36 52.87,42.36 54.38,40.86 54.38,40.8 55.61,39.57 63.74,39.57 64.52,38.79 v5(73.53,38.79) ; v5(75.69,18.34) 77.22,16.81 93.98,16.81 94.49,17.32 U1#2.46
PA21: length 140.1
  Bottom Layer w0.3: 步进电机1#2.8 19.43,96.57 19.43,100.13 20.07,100.76 34.16,100.76 35.69,99.24 35.69,89.33 37.21,87.81 47.5,87.81 49.53,85.78 49.53,76.89 50.29,76.12 55.37,76.12 56.64,74.85 56.64,68.25 57.51,67.38 95.16,67.38 97.41,65.14 97.41,41.33 97.07,40.99 U1#2.64
PA22: length 123.4
  Bottom Layer w0.3: 步进电机1#2.7 20.7,99.45 21,99.75 33.27,99.75 34.54,98.48 34.54,88.95 36.32,87.17 46.61,87.17 48.64,85.14 48.64,76.25 49.4,75.49 55.12,75.49 55.75,74.85 55.75,67.36 56.39,66.73 95.25,66.73 96.77,65.2 96.77,51.61 96.2,51.04 94.59,51.04 U1#2.72
PA23: length 85.7
  Top Layer w0.3: UART2#2.4 39.88,72.19 41.47,70.6 41.47,61.33 41.91,60.88 46.86,60.88 48.39,59.36 v5(48.39,56.19) ; v5(79.63,40.56) 80.52,39.68 93.26,39.68 U1#2.62
  Bottom Layer w0.3: v5(79.63,40.56) 79.63,52.38 77.09,54.92 49.66,54.92 v5(48.39,56.19)
PA24: length 66.1
  Top Layer w0.3: v5(90.04,63.3) 89.41,62.66 v5(80.9,62.66) ; v5(59.69,62.66) v5(62.1,62.66)
  Bottom Layer w0.3: v5(90.04,63.3) 90.3,63.55 95.5,63.55 96.14,62.92 96.14,56.69 95.67,56.23 U1#2.76 ; v5(62.1,62.66) v5(80.9,62.66) ; v5(59.69,62.66) 51.69,62.66 50.93,63.42 50.93,66.98 50.67,67.23 44.56,67.23 PWM#2.3
PA25: length 112.9
  Top Layer w0.3: v5(33.91,60) 33.91,64.57 33.02,65.46 32,65.46 28.07,69.39 28.07,78.41 32,82.35 UART3#2.3 ; v5(52.83,45.52) 53.59,44.76 v5(65.63,44.76) ; v5(77.47,44.76) 83.69,44.76 84.58,45.64 84.58,55.42 85.38,56.23 U1#2.75
  Bottom Layer w0.3: v5(65.63,44.76) v5(77.47,44.76) ; v5(52.83,45.52) 37.97,45.52 35.69,47.8 35.69,55.68 33.91,57.46 v5(33.91,60)
PA26: length 119.6
  Top Layer w0.3: v5(67.06,29.64) 71.88,29.64 72.64,30.4 72.64,57.84 74.93,60.12 91.43,60.12 91.45,60.1 92.45,60.1 92.46,60.12 93.13,60.12 U1#2.78
  Bottom Layer w0.3: v5(67.06,29.64) 59.53,29.64 59.43,29.54 55.89,29.54 55.79,29.64 54.48,29.64 53.85,30.28 38.86,30.28 37.34,28.75 11.56,28.75 10.8,27.99 6.16,27.99 摇杆1#2.2
PA27: length 114.1
  Top Layer w0.3: v5(66.93,31.42) 71.12,31.42 71.75,32.06 71.75,58.22 v5(72.52,58.98) ; v5(79.88,58.85) 91.86,58.85 U1#2.77
  Bottom Layer w0.3: 摇杆1#2.3 36.09,30.05 37.21,31.17 54.1,31.17 54.86,31.93 55.87,31.93 55.89,31.95 59.43,31.95 59.44,31.93 66.42,31.93 v5(66.93,31.42) ; v5(72.52,58.98) 79.76,58.98 v5(79.88,58.85)
PA28: length 29.3
  Bottom Layer w0.3: U1#2.4 60.58,58.68 60.96,59.06 60.96,62.66 60.32,63.3 52.32,63.3 51.56,64.06 51.56,67.49 49.28,69.77 44.07,69.77 43.25,70.59 PWM#2.1
PA29: length 108.5
  Top Layer w0.3: v5(26.67,27.86) 25.53,29.01 25.53,44.12 24.77,44.88 v5(22.48,44.88)
  Bottom Layer w0.3: v5(22.48,44.88) 22.35,45.01 14.1,45.01 13.59,45.52 空余引脚#2.3 13.59,55.93 13.29,56.23 13.29,63.72 11.18,65.84 11.18,77.14 8,80.32 电机4#2.3 ; v5(26.67,27.86) 47.33,27.86 47.35,27.84 51.96,27.84 53.98,25.83 53.98,22.28 54.36,21.9 57.62,21.9 U1#2.34
PA30: length 153.7
  Top Layer w0.3: v5(82.55,26.34) 84.5,28.29 U1#2.53 ; 空余引脚#2.4 16.13,57.33 15.37,58.09 13.21,58.09 v5(12.57,58.73) ; v5(80.65,17.7) 79.63,16.69 75.56,16.69 73.15,19.1 v5(66.17,19.1) ; v5(26.54,25.2) 24.51,27.23 24.51,41.33 23.88,41.96 17.65,41.96 16.13,43.49 v5(16.13,47.04)
  Bottom Layer w0.3: v5(26.54,25.2) 27.69,25.2 28.32,25.83 28.32,26.72 28.83,27.23 51.82,27.23 52.96,26.09 52.96,21.13 54.85,19.25 66.02,19.25 v5(66.17,19.1) ; 3.17,77.78 8.89,77.78 10.16,76.51 10.16,63.93 11.43,62.66 12.19,62.66 12.57,62.28 v5(12.57,58.73) ; v5(82.55,26.34) 82.55,19.61 v5(80.65,17.7) ; 空余引脚#2.4 v5(16.13,47.04)
PA31: length 97.9
  Top Layer w0.3: U1#2.6 61.38,56.14 63.12,54.41 v5(63.12,51.36) ; v5(28.07,31.29) 55.24,31.29 55.89,31.95 65.3,31.95 66.93,33.58 66.93,36.43 67.18,36.69 v5(67.18,42.85) ; v5(18.67,47.42) v5(18.67,42.72)
  Bottom Layer w0.3: v5(67.18,42.85) 66.68,43.36 64.52,43.36 63.75,44.12 63.75,50.72 v5(63.12,51.36) ; v5(18.67,42.72) 18.67,38.66 21.72,35.61 26.54,35.61 27.69,34.47 27.69,31.67 v5(28.07,31.29) ; 空余引脚#2.5 v5(18.67,47.42)
PB00: length 120.2
  Top Layer w0.3: v5(13.21,16.36) 15.11,16.36 16.64,14.84 16.64,8.56 17.78,7.42 59.69,7.42 v5(62.48,4.62) ; v5(13.21,16.36) 13.21,18.94 LED11#2.1 ; v5(13.21,16.36) 13.21,14.91 SW4#2.2
  Bottom Layer w0.3: U1#2.51 91.95,25.58 93.09,24.44 96.14,24.44 96.39,24.18 96.39,14.66 96.14,14.4 95,14.4 94.99,14.38 91.45,14.38 91.43,14.4 89.92,14.4 88.77,15.55 73.28,15.55 71.37,13.64 71.37,6.66 69.34,4.62 v5(62.48,4.62)
PB01: length 114.1
  Top Layer w0.3: SW5#2.2 20.41,14.61 v5(20.41,16.31) ; v5(20.41,16.31) 21.59,16.31 22.73,15.16 22.73,8.4 23.03,8.1 60.66,8.1 64.26,4.5 86.11,4.5 86.61,5 86.61,9.07 87.88,10.34 95.5,10.34 96.39,11.23 96.39,25.2 95.84,25.75 U1#2.52 ; v5(20.41,16.31) 17.28,16.31 16.51,17.07 LED12#2.1
PB02: length 76.9
  Top Layer w0.3: LED15#2.1 20.54,18.85 v5(22.61,18.85) 22.61,17.2 23.62,16.18 26.54,16.18 27.05,15.67 SW6#2.2
  Inner2 w0.3: v5(22.61,18.85) 22.61,30.4 20.07,32.94 20.07,46.41 20.45,46.79 v5(21.08,46.79)
  Bottom Layer w0.3: v5(21.08,46.79) 21.84,46.03 23.37,46.03 24.51,44.88 34.54,44.88 36.41,43.02 53,43.02 53.43,43.44 U1#2.15
PB03: length 85.5
  Top Layer w0.3: v5(36.26,16.94) 36.24,16.92 36.24,11.69 36.45,11.48 50.8,11.48 51.69,12.37 51.69,14.78 53.59,16.69 55.87,16.69 55.89,16.71 59.43,16.71 59.44,16.69 65.02,16.69 65.6,17.26 65.6,18.81 65.56,18.85 65.56,27.38 v5(65.6,27.42) ; v5(36.26,16.94) 43.05,16.94 43.27,17.16 LED16#2.1 ; v5(36.26,16.94) 34.67,16.94 34.29,16.56 SW7#2.2
  Inner2 w0.3: v5(65.6,27.42) 65.6,31.86 67.44,33.71 67.44,38.28 67.06,38.66 64.64,38.66 61.21,42.09 59.44,42.09 59.43,42.11 58.43,42.11 58.41,42.09 57.57,42.09 U1#2.17
PB04: length 32.6
  Top Layer w0.3: U1#2.8 58.97,53.65 61.09,53.65 61.6,53.14 v5(61.6,50.22)
  Inner1 w0.3: v5(49.78,48.69) 49.53,48.44 49.53,44.63 48.98,44.08 45.55,44.08 45.09,43.61 45.09,41.45 44.2,40.56 蓝牙1#2.4
  Bottom Layer w0.3: v5(61.6,50.22) 61.21,49.84 50.93,49.84 v5(49.78,48.69)
PB05: length 35.8
  Inner1 w0.3: 蓝牙1#2.3 44.96,38.02 45.85,38.91 45.85,42.85 46.23,43.23 49.53,43.23 50.42,44.12 v5(50.42,47.68)
  Bottom Layer w0.3: U1#2.10 59.22,51.36 61.98,51.36 62.61,50.72 62.61,49.2 60.71,47.3 54.86,47.3 53.85,48.31 51.05,48.31 v5(50.42,47.68)
PB06: length 70.2
  Top Layer w0.3: SW8#2.2 41.15,14.78 41.15,15.63 41.57,16.05 v5(43.31,16.05) 45.59,16.05 46.61,17.07 LED17#2.1
  Inner2 w0.3: v5(67.44,24.82) 67.44,25.83 67.18,26.09 64.9,26.09 64.64,26.34 64.64,31.55 64.13,32.06 57.7,32.06 U1#2.25
  Bottom Layer w0.3: v5(43.31,16.05) 43.31,11.86 43.82,11.35 49.91,11.35 51.69,9.58 61.21,9.58 62.6,10.96 65.29,10.96 65.68,11.35 65.68,12.26 65.66,12.29 65.66,16.09 66.29,16.73 67.86,16.73 68.07,16.94 68.07,24.18 v5(67.44,24.82)
PB07: length 61.3
  Top Layer w0.3: v5(72.01,16.43) 69.34,13.77 67.06,13.77 65.41,12.12 65.41,11.35 64.01,9.96 54.1,9.96 52.96,11.1 v5(52.96,14.28) ; LED18#2.1 50.42,15.04 50.04,14.66 SW9#2.2
  Inner2 w0.3: U1#2.26 62.78,30.74 63.5,30.02 63.5,25.07 65.28,23.29 v5(71.75,23.29)
  Bottom Layer w0.3: v5(72.01,16.43) 72.52,16.94 72.52,22.53 v5(71.75,23.29) ; v5(50.42,15.93) 52.32,15.93 52.96,15.29 v5(52.96,14.28)
PB08: length 76
  Top Layer w0.3: v5(26.8,24.05) 26.03,24.05 23.24,26.85 23.24,39.8 22.86,40.18 16.26,40.18 15.13,41.3 15.13,48.42 15.07,48.48 15.07,48.78 15.49,49.2 v5(20.83,49.2) ; v5(51.18,26.59) 54.78,26.59 U1#2.27
  Bottom Layer w0.3: v5(20.83,49.2) 21.21,49.58 空余引脚#2.6 ; v5(51.18,26.59) 30.99,26.59 28.45,24.05 v5(26.8,24.05)
PB09: length 85
  Inner2 w0.3: v5(62.1,20.75) 62.1,16.94 61.85,16.69 59.44,16.69 59.43,16.71 55.89,16.71 55.87,16.69 38.99,16.69 37.08,18.59 37.08,25.71 35.69,27.1 28.57,27.1 23.75,31.93 23.75,46.03 23.78,46.06 23.78,46.12 23.75,46.15 空余引脚#2.7
  Bottom Layer w0.3: U1#2.28 61.51,28.2 62.1,27.61 v5(62.1,20.75)
PB10: length 85.1
  Top Layer w0.3: v5(54.23,60) v5(61.85,60)
  Bottom Layer w0.3: U1#2.49 90.51,23.21 89.41,24.31 89.41,26.98 88.14,28.25 86.11,28.25 81.98,32.37 81.98,58.66 80.65,60 v5(61.85,60) ; v5(54.23,60) 53.72,60.5 50.93,60.5 50.29,61.14 50.29,63.97 49.53,64.74 44.41,64.74 44.2,64.95 44.2,65.06 PWM#2.5
PB11: length 84.8
  Bottom Layer w0.3: U1#2.47 91.91,20.62 89.15,20.62 88.71,21.07 88.71,24.24 80.77,32.18 80.77,56.82 80.14,57.46 47.75,57.46 47.24,57.96 47.24,59.74 46.48,60.5 44.45,60.5 43.25,61.7 PWM#2.7
PB12: length 73.6
  Top Layer w0.3: UART3#2.4 32.77,84.89 27.18,79.3 27.18,68.89 31.37,64.69 32.64,64.69 33.15,64.19 v5(33.15,59.74)
  Bottom Layer w0.3: U1#2.16 58.93,43.74 57.91,44.76 37.85,44.76 35.18,47.42 35.18,54.92 33.15,56.95 v5(33.15,59.74)
  vias: v5(173.77,89.42)
PB13: length 99.4
  Top Layer w0.3: v5(51.69,24.56) 54.36,21.9 61.47,21.9 63.12,23.55 63.12,28.88 67.55,33.31 67.55,36.48 67.94,36.88 67.94,43.99 67.73,44.21 67.03,44.21 66.42,43.6 66.42,41.07 66.21,40.86 58.97,40.86 U1#2.18
  Bottom Layer w0.3: v5(51.69,24.56) 51.43,24.82 30.48,24.82 29.08,23.42 25.57,23.42 25.27,23.72 25.27,26.09 23.18,28.18 12,28.18 11.05,27.23 11.05,26.62 9.4,24.97 摇杆1#2.1
  vias: v5(172.76,90.69)
PB14: length 120.9
  Top Layer w0.3: U2#2.6 19.04,75.25 20.19,74.09 20.19,62.41 26.42,56.19 32.64,56.19 33.4,55.42 33.4,47.8 37.34,43.87 49.91,43.87 51.69,42.09 55.87,42.09 55.89,42.11 59.43,42.11 59.44,42.09 v5(65.53,42.09)
  Bottom Layer w0.3: U1#2.48 93.18,19.36 88.52,19.36 87.88,19.99 87.88,23.42 79.63,31.67 79.63,39.29 76.84,42.09 v5(65.53,42.09)
  vias: v5(173.27,87.01)
PB15: length 67.3
  Top Layer w0.3: U2#2.7 20.05,77.79 21.08,76.76 21.08,62.92 27.05,56.95 33.15,56.95 35.18,54.92 35.18,50.22 36.45,48.95 v5(42.04,48.95) ; U1#2.11 54.65,48.52 54.1,49.07 54.1,49.71 52.75,51.06 v5(43.69,51.06)
  Bottom Layer w0.3: v5(43.69,51.06) 43.14,51.06 42.93,50.85 42.93,49.33 42.54,48.95 v5(42.04,48.95)
PB16: length 68.9
  Top Layer w0.3: U1#2.13 56.09,46.28 54.23,46.28 53.34,47.17 53.34,49.58 52.96,49.96 37.08,49.96 35.94,51.11 35.94,55.42 33.66,57.71 26.92,57.71 21.97,62.66 21.97,78.79 20.43,80.33 U2#2.8
PB17: length 114.3
  Bottom Layer w0.3: U1#2.65 85.81,43.53 85.3,44.04 85.3,63.34 83.31,65.33 54.53,65.33 54.23,65.63 54.23,73.58 53.59,74.22 34.16,74.22 32.64,75.74 32.64,96.57 31.37,97.84 步进电机1#2.1
PB18: length 83.7
  Top Layer w0.3: v5(48.9,52.5) 47.5,53.9 47.5,59.36 46.74,60.12 41.27,60.12 40.64,60.76 40.64,68.38 39.37,69.65 UART2#2.3 ; v5(78.36,41.96) 78.87,41.45 84.71,41.45 85.22,40.95 89.53,40.95 90.81,42.22 93.34,42.22 94.49,43.36 U1#2.66
  Bottom Layer w0.3: v5(78.36,41.96) 78.36,51.23 77.19,52.4 48.99,52.4 v5(48.9,52.5)
PB19: length 120.3
  Top Layer w0.3: v5(86.23,45.39) v5(86.23,42.34)
  Bottom Layer w0.3: v5(86.23,45.39) 86.23,63.68 83.69,66.22 55.29,66.22 54.99,66.52 54.99,74.09 54.17,74.92 35.37,74.92 33.27,77.01 33.27,97.97 32.34,98.91 26.03,98.91 25.78,98.65 步进电机1#2.3 ; v5(86.23,42.34) 87.59,40.99 U1#2.63
PB20: length 108.1
  Top Layer w0.3: U1#2.71 86.02,51.15 85.22,50.34 85.22,43.99 84.71,43.49 77.09,43.49 76.45,42.85 76.45,37.52 v5(76.07,37.14) ; v5(65.53,37.14) 55.12,37.14 54.1,38.15 54.1,39.29 52.45,40.95 50.93,40.95 49.4,42.47 36.32,42.47 32.64,46.15 26.03,46.15 22.48,49.71 22.48,57.71 18.67,61.52 18.67,64.31 17.89,65.09 U2#2.2
  Bottom Layer w0.3: v5(65.53,37.14) v5(76.07,37.14)
PB21: length 126.6
  Top Layer w0.3: v5(31.1,79.17) 31.1,76.14 32,75.24 52.07,75.24 53.04,74.26 v5(53.04,72.82)
  Bottom Layer w0.3: v5(31.1,79.17) 31.1,79.19 31.98,80.07 31.98,91.72 30.69,93.02 26.67,93.02 25.78,93.9 步进电机1#2.4 ; U1#2.55 91.91,30.78 87,30.78 84.2,33.58 84.2,63.04 82.68,64.57 53.72,64.57 53.04,65.24 v5(53.04,72.82)
PB22: length 131.7
  Top Layer w0.3: v5(52.07,72.7) 52.07,73.84 51.43,74.47 31.37,74.47 30.23,75.62 v5(30.23,77.01)
  Bottom Layer w0.3: v5(30.23,77.01) 30.23,78.92 29.84,79.3 24.89,79.3 23.24,80.95 步进电机1#2.6 ; v5(52.07,72.7) 52.07,64.57 52.83,63.81 81.15,63.81 83.06,61.9 83.06,33.33 86.74,29.64 91.43,29.64 91.45,29.62 92.45,29.62 92.46,29.64 93.73,29.64 94.49,30.4 U1#2.56
PB23: length 118.2
  Top Layer w0.3: v5(22.35,47.21) 23.67,45.9 25.02,45.9 26.03,44.88 26.03,30.53 28.45,28.12 53.72,28.12 55.12,29.52 61.21,29.52 61.72,29.01 61.72,24.56 61.47,24.31 59.44,24.31 59.43,24.33 57.59,24.33 U1#2.31
  Bottom Layer w0.3: 步进电机1#2.5 21.97,96.57 21.97,56.82 22.35,56.44 22.35,54.39 22.36,54.38 22.36,53.42 22.35,53.41 v5(22.35,47.21)
PB24: length 78.7
  Top Layer w0.3: v5(78.74,33.45) 85.85,33.45 89.66,29.64 91.43,29.64 91.45,29.62 94.99,29.62 95,29.64 97.03,29.64 97.54,30.15 97.54,52.76 96.61,53.69 U1#2.74
  Bottom Layer w0.3: 蜂鸣器1#2.2 51.18,37.39 53.98,34.6 65.91,34.6 67.06,33.45 v5(78.74,33.45)
PB25: length 110.4
  Inner2 w0.3: U1#2.73 91.4,53.69 89.79,55.3 89.79,57.96 89.15,58.6 85.85,58.6 85.09,59.36 85.09,64.44 83.06,66.47 57.79,66.47 55.75,68.5 55.75,80.38 54.74,81.39 49.59,81.39 47.88,79.68 47.88,76 46.74,74.85 43.69,74.85 41.02,72.19 41.02,62.66 40.13,61.77 29.59,61.77 26.29,58.47 空余引脚#2.8
PB26: length 101.4
  Inner2 w0.3: v5(38.35,15.62) 38.35,13 39.37,11.99 51.82,11.99 53.21,10.59 v5(54.88,10.59) ; 空余引脚#2.9 28.83,51.11 24.77,47.04 24.77,31.93 28.83,27.86 36.45,27.86 38.35,25.96 v5(38.35,19.74)
  Bottom Layer w0.3: v5(54.88,10.59) 59.82,10.59 61.09,11.86 61.09,17.32 62.1,18.34 67.22,18.34 67.52,18.64 67.52,19.4 66.8,20.12 61.01,20.12 60.71,20.42 60.71,22.4 59.98,23.12 U1#2.32 ; v5(38.35,19.74) v5(38.35,15.62)
PB27: length 63.7
  Inner2 w0.3: U1#2.33 56.09,20.88 49.15,20.88 48.64,21.39 48.64,26.21 47.62,27.23 40.39,27.23 38.99,28.63 29.21,28.63 25.53,32.31 25.53,45.9 26.67,47.04 28.57,47.04 31.37,49.84 空余引脚#2.10
$1N2097: length 3.4
  Top Layer w0.8: R2470#2.2 85.3,79.05 独立5V供电.2
$1N2098: length 2.9
  Top Layer w0.8: LED1驱动板1#2.2 61.08,82.64 R1470#2.2
$1N2102: length 2.6
  Top Layer w0.8: R3470#2.2 57.91,79.85 LED5V1#2.2
$1N3077: length 3.9
  Top Layer w1.2: LED12V#2.2 88.6,99.62 R31800.2
$1N6588: length 2.5
  Top Layer w0.3: R41k4#2.1 13.11,20.69 LED11#2.2
$1N6591: length 2.6
  Top Layer w0.3: R41k1#2.1 16.64,20.79 LED12#2.2
$1N6592: length 2.5
  Top Layer w0.3: LED15#2.2 20.45,20.54 R41k2#2.1
$1N6593: length 2.2
  Top Layer w0.3: LED16#2.2 43.31,19.75 R41k3#2.1
$1N6603: length 2.2
  Top Layer w0.3: R41k5#2.1 46.74,19.78 LED17#2.2
$1N6604: length 2.4
  Top Layer w0.3: LED18#2.2 50.43,19.79 R41k6#2.1
$1N7225: length 9.5
  Top Layer w1.2: INT+1#2.1 67.31,97.08 67.93,96.46 D2#2.2

## Copper pours and planes (outline as drawn; the poured copper is in the pictures)
GND on Top Layer: -5.21,105.72 77.09,105.72 79.88,102.92 79.88,97.21 80.14,96.95 79.76,96.57 79.76,94.92 75.44,94.92 75.18,94.67 75.18,86.03 75.06,85.9 64.39,85.9 64.26,85.78 64.26,78.92 64.52,78.66 77.47,78.66 77.98,79.17 77.98,81.59 88.14,81.59 88.65,82.09 88.65,86.92 89.41,87.68 89.41,96.19 89.28,96.32 80.92,96.32 80.65,96.59 80.65,105.72 81.28,106.35 108.33,106.1 110.24,103.94 110.87,1.45 102.74,-6.68 -18.41,-6.68 -20.57,-4.52 -20.57,93.14 -12.07,101.65 -9.27,101.65
GND on Bottom Layer: -5.97,105.84 76.71,105.84 79.88,102.67 79.88,95.05 80.01,94.92 79.88,94.79 75.69,94.79 75.69,88.06 75.82,87.94 75.82,85.9 76.07,85.65 65.02,85.65 64.9,85.52 64.9,78.9 64.64,78.65 77.27,78.65 78.23,79.61 78.23,82.35 87.63,82.35 88.14,81.84 88.52,82.22 88.52,87.43 89.41,88.32 89.41,95.56 81.79,95.56 81.41,95.17 81.41,96.37 80.65,97.13 80.65,103.94 81.03,104.32 105.93,104.32 107.7,102.67 107.7,-3.38 106.04,-5.03 -0.25,-5.03 -4.06,-1.22 -4.06,103.94
GND on Inner2: -7.11,105.33 77.34,105.33 79.88,102.79 79.88,95.43 79.55,95.1 75.23,95.1 75.23,85.8 75.13,85.7 64.64,85.7 64.64,78.92 64.77,78.79 77.14,78.79 77.34,79 77.34,81.46 77.98,82.09 87.63,82.09 87.88,81.84 88.39,82.35 88.39,88.7 89.53,89.84 89.53,95.56 80.52,95.56 80.39,95.43 80.39,104.33 80.65,104.58 102.28,104.32 102.62,104.32 102.62,-4.39 97.66,-9.35 2.29,-9.35 -4.83,-2.23 -4.83,103.05

## Text on the board
Top Silkscreen Layer: OLED1 | U1 | A29 | A30 | 5V | A17 | A18 | 3.3V | G | B00 | CS0B20 | SCLKB16 | PICOB15 | POCIB14 | A07 | A31 | B08 | B01 | B09 | SCLA11 | B25 | B02 | B26 | SDAA10 | B27 | B03 | CS0A2 | POCIA13 | B06 | PICOA14 | A09 | SCLKA12 | A08 | SDAA16 | SCLA15 | B07 | 5V2 | 5V1 | 2 | Y | X | 1 | ST2 | ST1 | DIR2 | DIR1 | EN2 | EN1 | ADC | SW | 摇杆 | TXD单A00 | TXD单A23 | TXD单B12 | TXD单B04 | 驱动板供电 | 降压供电 | 开 | 关 | 3v3
